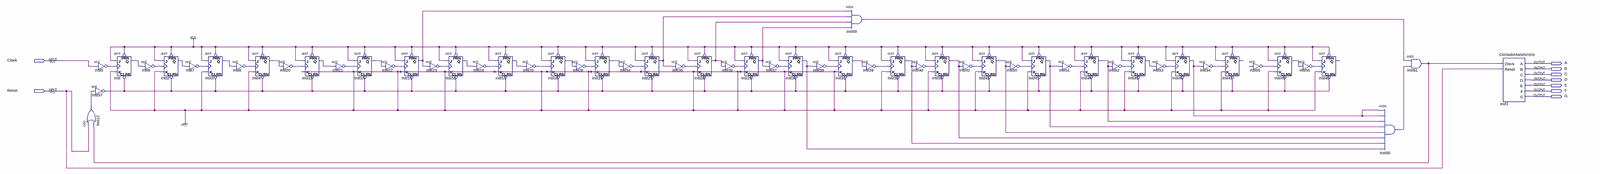
[diagram p0: schematic sheet, whole]
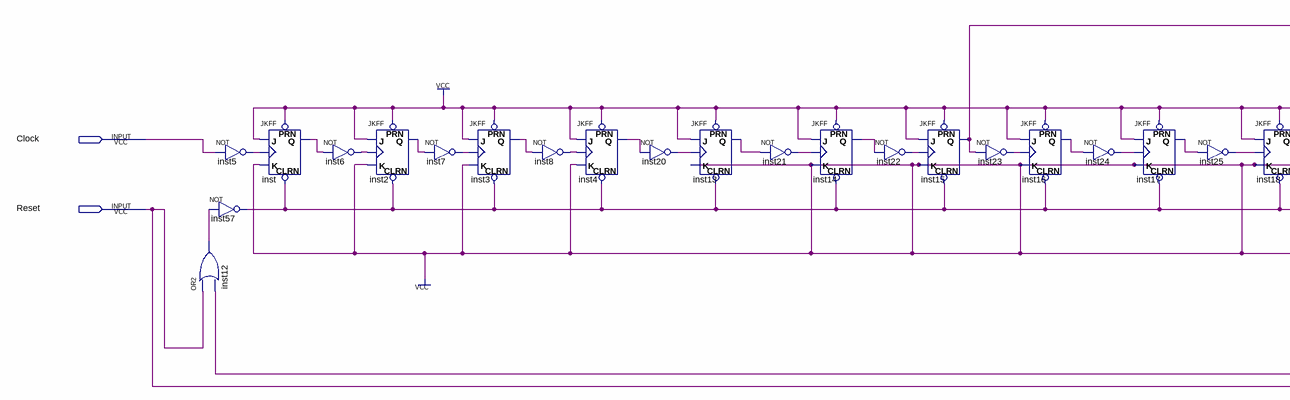
[diagram p1: schematic sheet, left part]
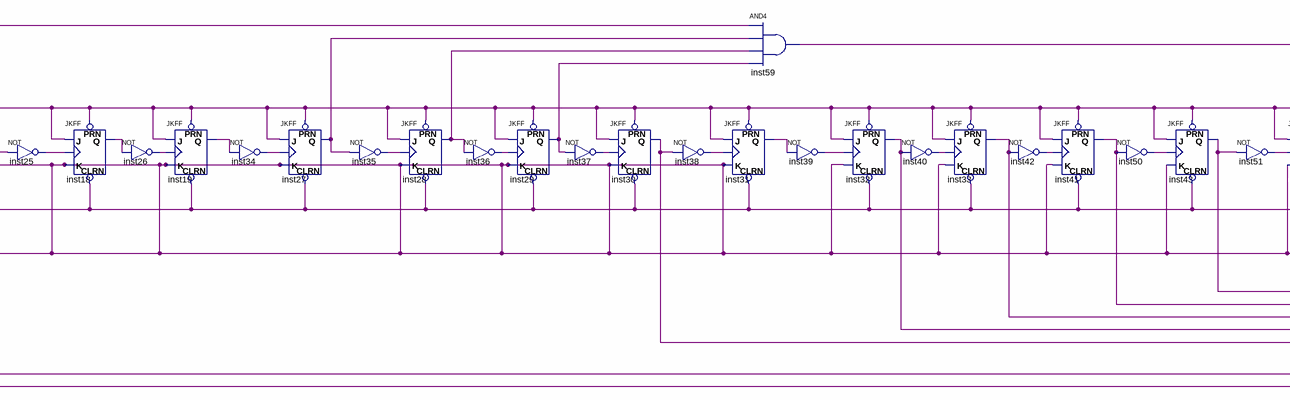
[diagram p2: schematic sheet, centre part]
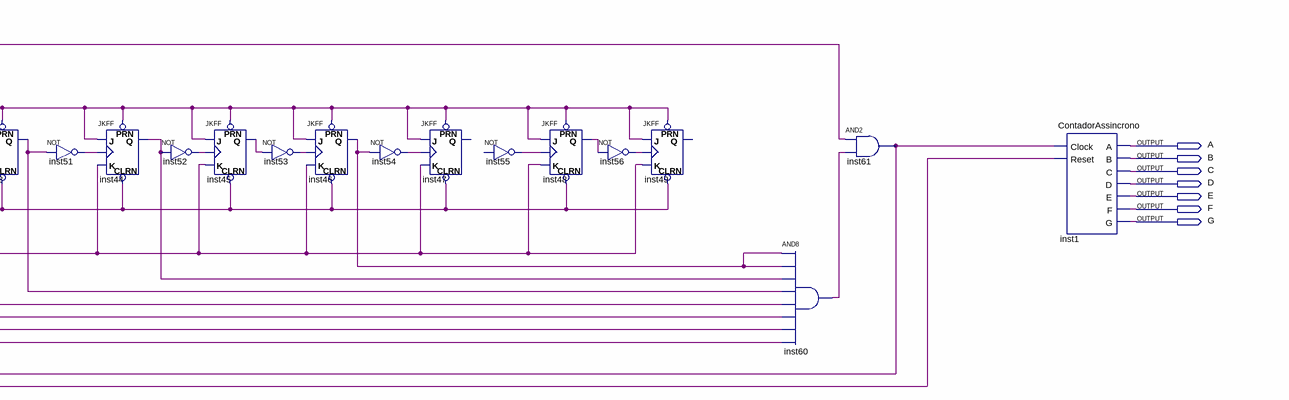
[diagram p3: schematic sheet, right part]
// Quartus schematic ContAutoAsc.bdf as structural Verilog: 58 symbols, 9 pins
module ContAutoAsc (
  input  Clock,
  input  Reset,
  output A,
  output B,
  output C,
  output D,
  output E,
  output F,
  output G
);

  wire inst2_q, inst3_q, inst4_q, inst5_out, inst6_out, inst7_out, inst8_out, inst12_out, inst13_q, inst14_q,
       inst15_q, inst16_q, inst17_q, inst18_q, inst19_q, inst20_out, inst21_out, inst22_out, inst23_out,
       inst24_out, inst25_out, inst26_out, inst27_q, inst28_q, inst29_q, inst30_q, inst31_q, inst32_q,
       inst33_q, inst34_out, inst35_out, inst36_out, inst37_out, inst38_out, inst39_out, inst40_out,
       inst41_q, inst42_out, inst43_q, inst44_q, inst45_q, inst46_q, inst48_q, inst50_out, inst51_out,
       inst52_out, inst53_out, inst54_out, inst55_out, inst56_out, inst57_out, inst59_out, inst60_out,
       inst61_out, inst_q;

  not inst5 (inst5_out, Clock);
  not inst57 (inst57_out, inst12_out);
  or inst12 (inst12_out, Reset, inst61_out);
  JKFF inst (.PRN(1'b1), .CLRN(inst57_out), .K(1'b1), .J(1'b1), .CLK(inst5_out), .Q(inst_q));
  not inst6 (inst6_out, inst_q);
  JKFF inst2 (.PRN(1'b1), .CLRN(inst57_out), .K(1'b1), .J(1'b1), .CLK(inst6_out), .Q(inst2_q));
  not inst7 (inst7_out, inst2_q);
  JKFF inst3 (.PRN(1'b1), .CLRN(inst57_out), .K(1'b1), .J(1'b1), .CLK(inst7_out), .Q(inst3_q));
  JKFF inst4 (.PRN(1'b1), .CLRN(inst57_out), .K(1'b1), .J(1'b1), .CLK(inst8_out), .Q(inst4_q));
  not inst8 (inst8_out, inst3_q);
  not inst20 (inst20_out, inst4_q);
  JKFF inst13 (.PRN(1'b1), .CLRN(inst57_out), .K(1'b1), .J(1'b1), .CLK(inst20_out), .Q(inst13_q));
  not inst21 (inst21_out, inst13_q);
  JKFF inst14 (.PRN(1'b1), .CLRN(inst57_out), .K(1'b1), .J(1'b1), .CLK(inst21_out), .Q(inst14_q));
  not inst22 (inst22_out, inst14_q);
  JKFF inst15 (.PRN(1'b1), .CLRN(inst57_out), .K(1'b1), .J(1'b1), .CLK(inst22_out), .Q(inst15_q));
  not inst23 (inst23_out, inst15_q);
  JKFF inst16 (.PRN(1'b1), .CLRN(inst57_out), .K(1'b1), .J(1'b1), .CLK(inst23_out), .Q(inst16_q));
  not inst24 (inst24_out, inst16_q);
  JKFF inst17 (.PRN(1'b1), .CLRN(inst57_out), .K(1'b1), .J(1'b1), .CLK(inst24_out), .Q(inst17_q));
  not inst25 (inst25_out, inst17_q);
  JKFF inst18 (.PRN(1'b1), .CLRN(inst57_out), .K(1'b1), .J(1'b1), .CLK(inst25_out), .Q(inst18_q));
  not inst26 (inst26_out, inst18_q);
  JKFF inst19 (.PRN(1'b1), .CLRN(inst57_out), .K(1'b1), .J(1'b1), .CLK(inst26_out), .Q(inst19_q));
  not inst34 (inst34_out, inst19_q);
  JKFF inst27 (.PRN(1'b1), .CLRN(inst57_out), .K(1'b1), .J(1'b1), .CLK(inst34_out), .Q(inst27_q));
  not inst35 (inst35_out, inst27_q);
  JKFF inst28 (.PRN(1'b1), .CLRN(inst57_out), .K(1'b1), .J(1'b1), .CLK(inst35_out), .Q(inst28_q));
  not inst36 (inst36_out, inst28_q);
  JKFF inst29 (.PRN(1'b1), .CLRN(inst57_out), .K(1'b1), .J(1'b1), .CLK(inst36_out), .Q(inst29_q));
  not inst37 (inst37_out, inst29_q);
  JKFF inst30 (.PRN(1'b1), .CLRN(inst57_out), .K(1'b1), .J(1'b1), .CLK(inst37_out), .Q(inst30_q));
  not inst38 (inst38_out, inst30_q);
  and inst59 (inst59_out, inst15_q, inst27_q, inst28_q, inst29_q);
  JKFF inst31 (.PRN(1'b1), .CLRN(inst57_out), .K(1'b1), .J(1'b1), .CLK(inst38_out), .Q(inst31_q));
  not inst39 (inst39_out, inst31_q);
  JKFF inst32 (.PRN(1'b1), .CLRN(inst57_out), .K(1'b1), .J(1'b1), .CLK(inst39_out), .Q(inst32_q));
  not inst40 (inst40_out, inst32_q);
  JKFF inst33 (.PRN(1'b1), .CLRN(inst57_out), .K(1'b1), .J(1'b1), .CLK(inst40_out), .Q(inst33_q));
  not inst42 (inst42_out, inst33_q);
  JKFF inst41 (.PRN(1'b1), .CLRN(inst57_out), .K(1'b1), .J(1'b1), .CLK(inst42_out), .Q(inst41_q));
  not inst50 (inst50_out, inst41_q);
  JKFF inst43 (.PRN(1'b1), .CLRN(inst57_out), .K(1'b1), .J(1'b1), .CLK(inst50_out), .Q(inst43_q));
  not inst51 (inst51_out, inst43_q);
  JKFF inst44 (.PRN(1'b1), .CLRN(inst57_out), .K(1'b1), .J(1'b1), .CLK(inst51_out), .Q(inst44_q));
  not inst52 (inst52_out, inst44_q);
  JKFF inst45 (.PRN(1'b1), .CLRN(inst57_out), .K(1'b1), .J(1'b1), .CLK(inst52_out), .Q(inst45_q));
  not inst53 (inst53_out, inst45_q);
  JKFF inst46 (.PRN(1'b1), .CLRN(inst57_out), .K(1'b1), .J(1'b1), .CLK(inst53_out), .Q(inst46_q));
  not inst54 (inst54_out, inst46_q);
  JKFF inst47 (.PRN(1'b1), .CLRN(inst57_out), .K(1'b1), .J(1'b1), .CLK(inst54_out));  // open: Q
  // NOT inst55 has open pins: IN=open, OUT=inst55_out
  JKFF inst48 (.PRN(1'b1), .CLRN(inst57_out), .K(1'b1), .J(1'b1), .CLK(inst55_out), .Q(inst48_q));
  not inst56 (inst56_out, inst48_q);
  JKFF inst49 (.PRN(1'b1), .CLRN(inst57_out), .K(1'b1), .J(1'b1), .CLK(inst56_out));  // open: Q
  and inst60 (inst60_out, inst46_q, inst46_q, inst44_q, inst43_q, inst41_q, inst33_q, inst32_q, inst30_q);
  and inst61 (inst61_out, inst59_out, inst60_out);
  ContadorAssincrono inst1 (.Clock(inst61_out), .Reset(Reset), .A(A), .B(B), .C(C), .D(D), .E(E), .F(F), .G(G));
endmodule
